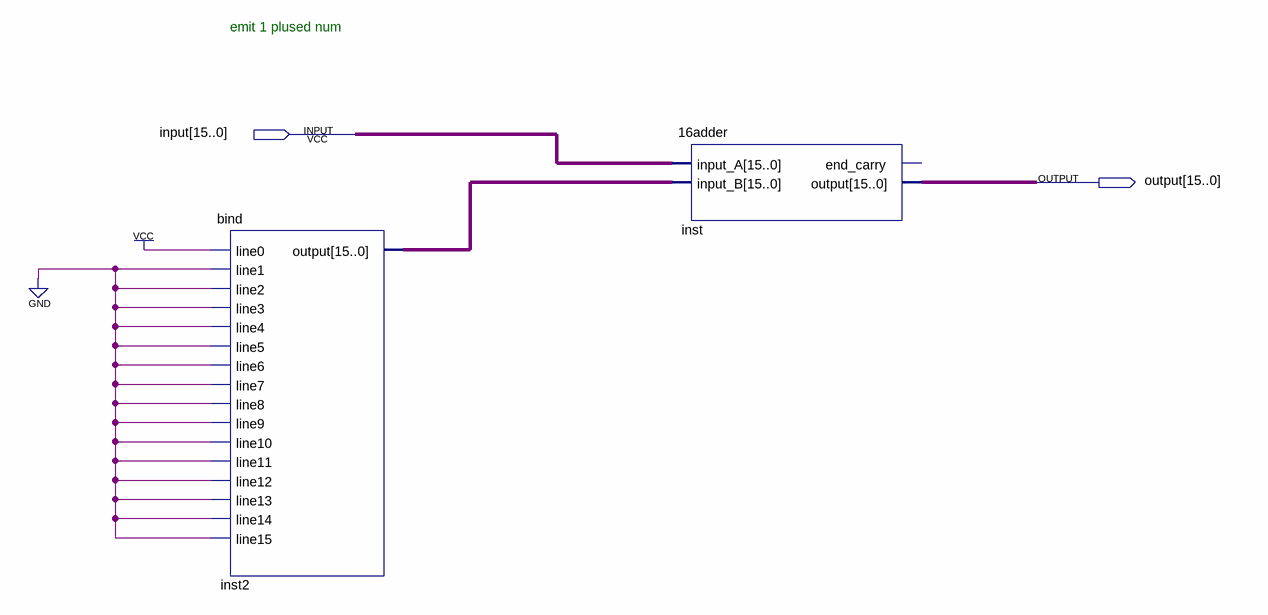
[diagram p0: schematic sheet]
// Quartus schematic 16bitplus1.bdf as structural Verilog: 2 symbols, 2 pins
module \16bitplus1  (
  input  [15:0] \input ,
  output [15:0] \output 
);

  wire [15:0] inst2_output;

  \bind  inst2 (
    .line0(1'b1), .line1(1'b0), .line2(1'b0), .line3(1'b0), .line4(1'b0), .line5(1'b0), .line6(1'b0),
    .line7(1'b0), .line8(1'b0), .line9(1'b0), .line10(1'b0), .line11(1'b0), .line12(1'b0), .line13(1'b0),
    .line14(1'b0), .line15(1'b0), .\output (inst2_output));
  \16adder  inst (.input_A(\input ), .input_B(inst2_output), .\output (\output ));  // open: end_carry

  // Notes on the sheet:
  //   emit 1 plused num
endmodule
